# EAGLE board NHK2016mother (EAGLE 6.2)
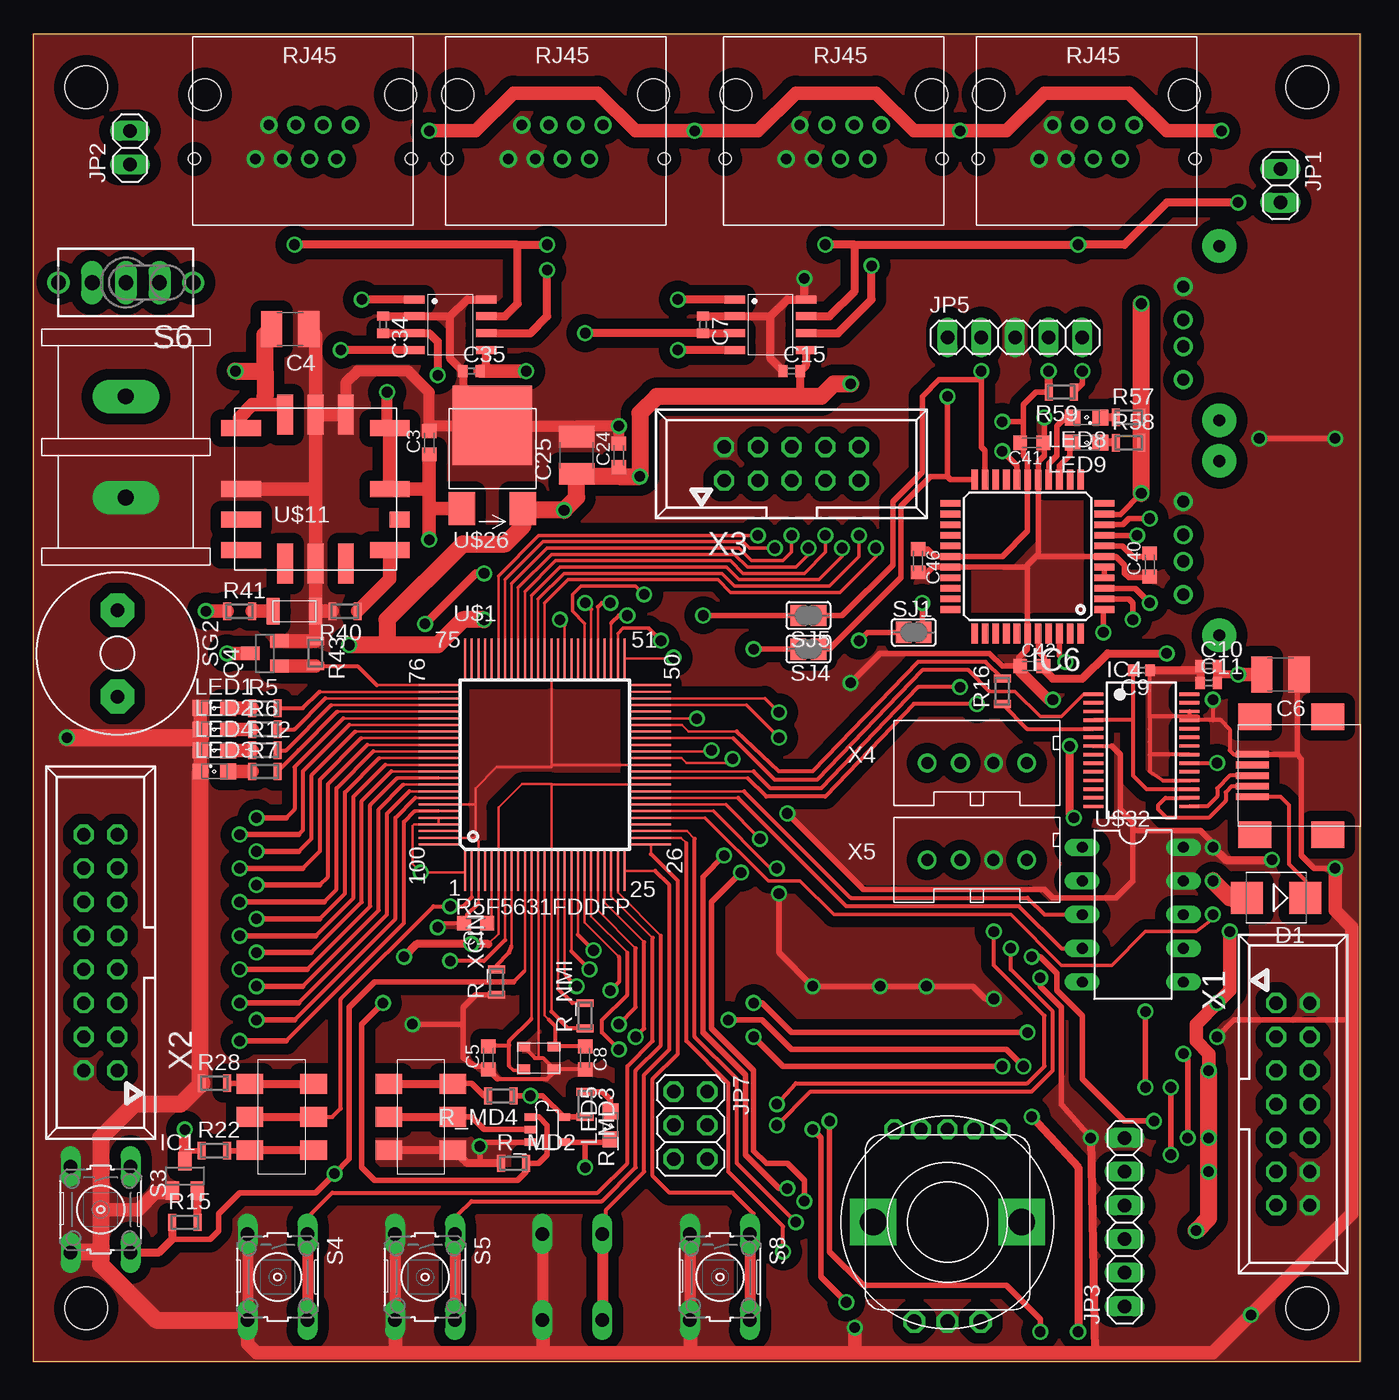
[diagram p2: board, top side]
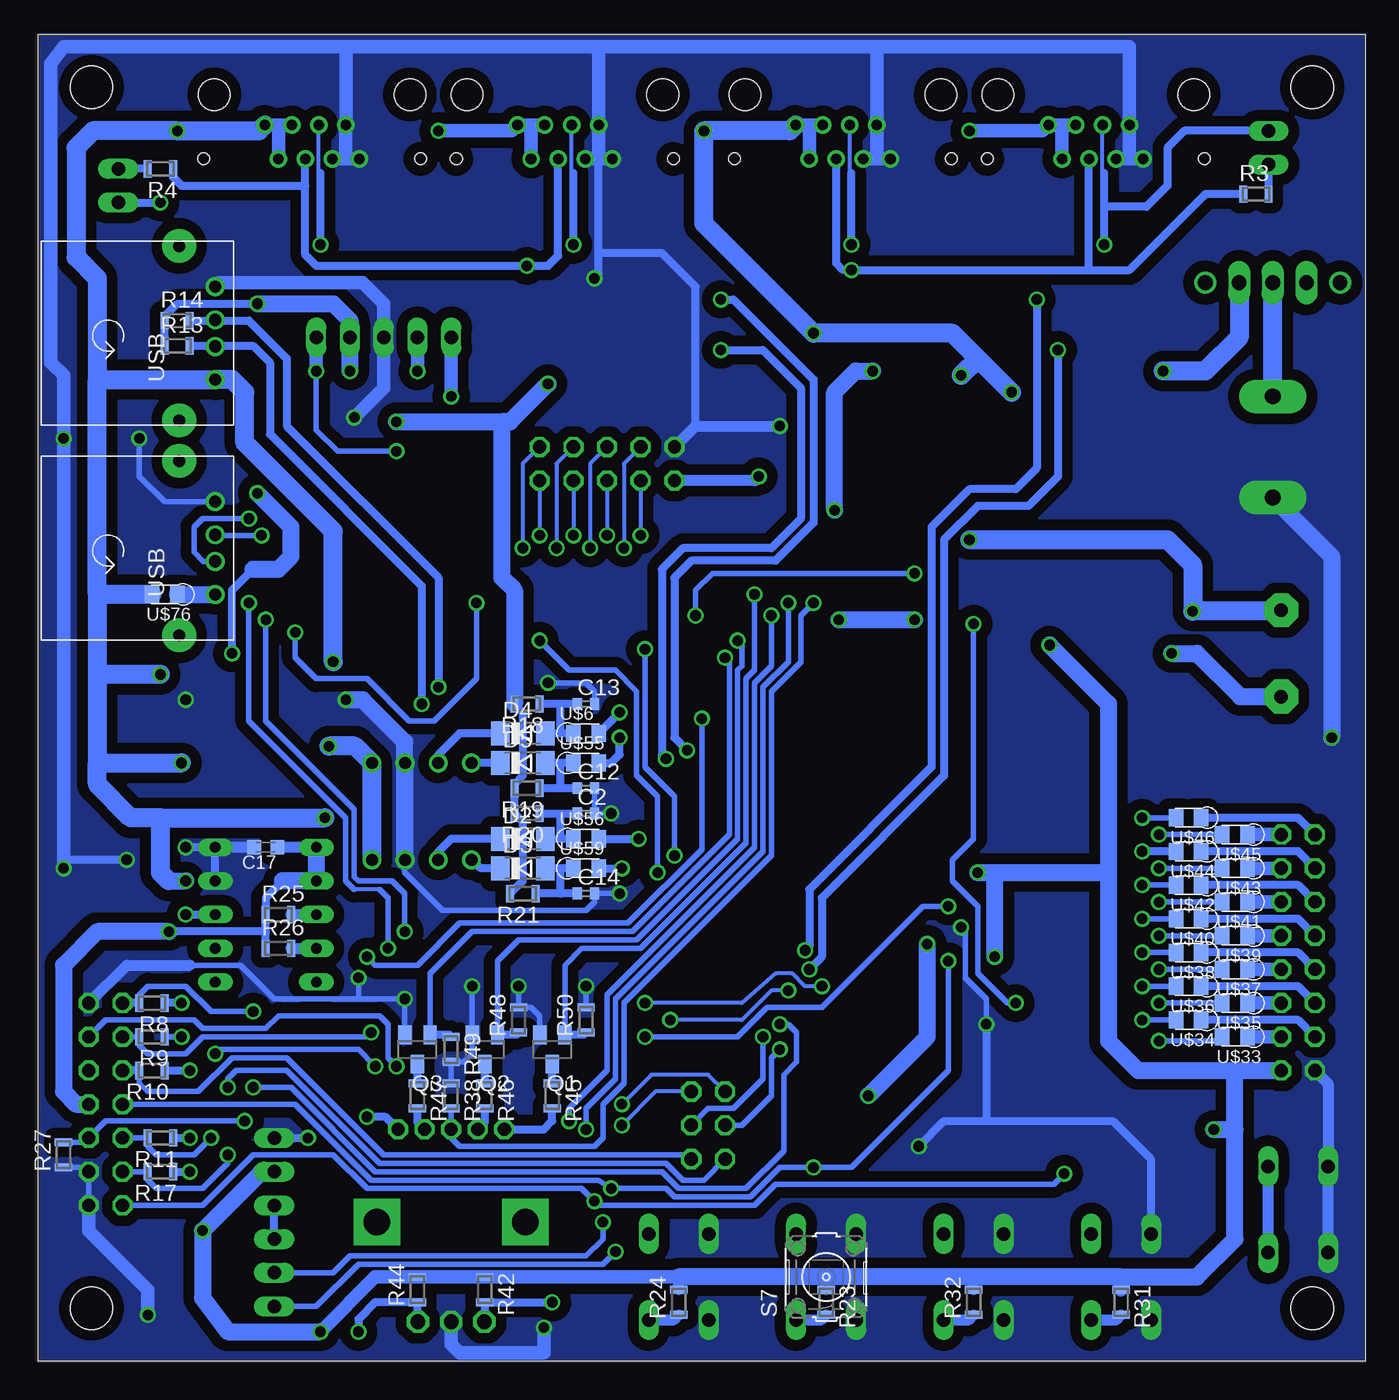
[diagram p3: board, bottom side, seen from below]

Size 100 x 100 mm. Coordinates in mm from the lower left corner, seen from the top.
Outline: 0,0 100,0 100,100 0,100 0,0
Copper layers (1*16): Top 0.035mm / dielectric 1.5mm / Bottom 0.035mm
Design rules "default": minimum track width 0.1mm, minimum drill 24mil, track to track 8mil, track to pad 8mil, pad to pad 8mil, via to via 8mil, smd to smd 8mil, copper to edge 0mil, drill to drill 8mil, minimum pad ring 10mil, minimum via ring 8mil, stop-mask expansion 4mil, vias tented up to drill 0mil, thermal gap 10mil
Holes 3.2 mm at 4,96 4,4 96,4 96,96

## Footprints (pad centres in the part's own frame; a part is rotated, then mirrored left to right if it is on the bottom)
C0603K = smd 1.05 x 1.08: 1 -0.875,0; 2 0.875,0
C0402 = smd 0.7 x 0.9: 1 -0.65,0; 2 0.65,0
C3225 = smd 1.6 x 2.7: 1 -1.4,0; 2 1.4,0
SMB = smd 2.4 x 2.4: A 2.2,0; C -2.2,0
SOD80C = smd 1.4 x 1.8: A 1.7,0; C -1.7,0
SOT23B-3 = smd 1 x 1.4: 1 -0.95,-1.1; 2 0.95,-1.1; 3 0,1.1
SSOP28 = smd 0.25 x 1.5: 1 -4.225,-3.625; 2 -3.575,-3.625; 3 -2.925,-3.625; 4 -2.275,-3.625; 5 -1.625,-3.625; 6 -0.975,-3.625; 7 -0.325,-3.625; 8 0.325,-3.625; 9 0.975,-3.625; 10 1.625,-3.625; 11 2.275,-3.625; 12 2.925,-3.625; 13 3.575,-3.625; 14 4.225,-3.625; 15 4.225,3.625; 16 3.575,3.625; 17 2.925,3.625; 18 2.275,3.625; 19 1.625,3.625; 20 0.975,3.625; 21 0.325,3.625; 22 -0.325,3.625; 23 -0.975,3.625; 24 -1.625,3.625; 25 -2.275,3.625; 26 -2.925,3.625; 27 -3.575,3.625; 28 -4.225,3.625
TQFP44 = smd 1.5 x 0.5: 1 -5.8,4; 2 -5.8,3.2; 3 -5.8,2.4; 4 -5.8,1.6; 5 -5.8,0.8; 6 -5.8,0; 7 -5.8,-0.8; 8 -5.8,-1.6; 9 -5.8,-2.4; 10 -5.8,-3.2; 11 -5.8,-4; 23 5.8,-4; 24 5.8,-3.2; 25 5.8,-2.4; 26 5.8,-1.6; 27 5.8,-0.8; 28 5.8,0; 29 5.8,0.8; 30 5.8,1.6; 31 5.8,2.4; 32 5.8,3.2; 33 5.8,4 | smd 0.5 x 1.5: 12 -4,-5.8; 13 -3.2,-5.8; 14 -2.4,-5.8; 15 -1.6,-5.8; 16 -0.8,-5.8; 17 0,-5.8; 18 0.8,-5.8; 19 1.6,-5.8; 20 2.4,-5.8; 21 3.2,-5.8; 22 4,-5.8; 34 4,5.8; 35 3.2,5.8; 36 2.4,5.8; 37 1.6,5.8; 38 0.8,5.8; 39 0,5.8; 40 -0.8,5.8; 41 -1.6,5.8; 42 -2.4,5.8; 43 -3.2,5.8; 44 -4,5.8
1X02 = drill 1.016 long: 1 -1.27,0; 2 1.27,0
1X06 = drill 1.016 long: 1 -6.35,0; 2 -3.81,0; 3 -1.27,0; 4 1.27,0; 5 3.81,0; 6 6.35,0
1X05 = drill 1.016 long: 1 -5.08,0; 2 -2.54,0; 3 0,0; 4 2.54,0; 5 5.08,0
2X03 = drill 1.016 octagon: 1 -2.54,-1.27; 2 -2.54,1.27; 3 0,-1.27; 4 0,1.27; 5 2.54,-1.27; 6 2.54,1.27
SML0805 = smd 1.2 x 1.2: A 1.05,0; C -1.05,0
SOT23 = smd 1 x 1.4: 1 -0.95,-1.1; 2 0.95,-1.1; 3 0,1.1
MINI_MELF-0102W = smd 0.6 x 1.3: 1 -0.95,0; 2 0.95,0
B3F-10XX = drill 1.016 long: 1 -3.251,2.261; 2 3.251,2.261; 3 -3.251,-2.261; 4 3.251,-2.261
TL3XYO = drill 1.1 pad 1.422 long: 1 -2.54,0; 2 0,0; 3 2.54,0 | drill 1.1 pad 1.676: M1 -5.08,0; M2 5.08,0
AL60P = drill 1.016 pad 2.54 octagon: 1 -3.251,0; 2 3.251,0
SJ = smd 1.168 x 1.6: 1 -0.762,0; 2 0.762,0
LQFP100 = smd 0.15 x 3: 1 -6.5,-7.5; 2 -6,-7.5; 3 -5.5,-7.5; 4 -5,-7.5; 5 -4.5,-7.5; 6 -4,-7.5; 7 -3.5,-7.5; 8 -3,-7.5; 9 -2.5,-7.5; 10 -2,-7.5; 11 -1.5,-7.5; 12 -1,-7.5; 13 -0.5,-7.5; 14 0,-7.5; 15 0.5,-7.5; 16 1,-7.5; 17 1.5,-7.5; 18 2,-7.5; 19 2.5,-7.5; 20 3,-7.5; 21 3.5,-7.5; 22 4,-7.5; 23 4.5,-7.5; 24 5,-7.5; 25 5.5,-7.5; 51 5.5,8.5; 52 5,8.5; 53 4.5,8.5; 54 4,8.5; 55 3.5,8.5; 56 3,8.5; 57 2.5,8.5; 58 2,8.5; 59 1.5,8.5; 60 1,8.5; 61 0.5,8.5; 62 0,8.5; 63 -0.5,8.5; 64 -1,8.5; 65 -1.5,8.5; 66 -2,8.5; 67 -2.5,8.5; 68 -3,8.5; 69 -3.5,8.5; 70 -4,8.5; 71 -4.5,8.5; 72 -5,8.5; 73 -5.5,8.5; 74 -6,8.5; 75 -6.5,8.5 | smd 3 x 0.15: 26 7.5,-5.5; 27 7.5,-5; 28 7.5,-4.5; 29 7.5,-4; 30 7.5,-3.5; 31 7.5,-3; 32 7.5,-2.5; 33 7.5,-2; 34 7.5,-1.5; 35 7.5,-1; 36 7.5,-0.5; 37 7.5,0; 38 7.5,0.5; 39 7.5,1; 40 7.5,1.5; 41 7.5,2; 42 7.5,2.5; 43 7.5,3; 44 7.5,3.5; 45 7.5,4; 46 7.5,4.5; 47 7.5,5; 48 7.5,5.5; 49 7.5,6; 50 7.5,6.5; 76 -8.5,6.5; 77 -8.5,6; 78 -8.5,5.5; 79 -8.5,5; 80 -8.5,4.5; 81 -8.5,4; 82 -8.5,3.5; 83 -8.5,3; 84 -8.5,2.5; 85 -8.5,2; 86 -8.5,1.5; 87 -8.5,1; 88 -8.5,0.5; 89 -8.5,0; 90 -8.5,-0.5; 91 -8.5,-1; 92 -8.5,-1.5; 93 -8.5,-2; 94 -8.5,-2.5; 95 -8.5,-3; 96 -8.5,-3.5; 97 -8.5,-4; 98 -8.5,-4.5; 99 -8.5,-5; 100 -8.5,-5.5
MUSB-5BF02AS-N = smd 0.5 x 2.5: 1 1.6,1.05; 2 0.8,1.05; 3 0,1.05; 4 -0.8,1.05; 5 -1.6,1.05 | smd 2 x 2.5: P$6 4.45,1.25; P$7 -4.45,1.25; P$8 4.45,6.75; P$9 -4.45,6.75
MCP2562 = smd 1.55 x 0.6: 1 -2.7,2.54; 2 -2.7,1.27; 3 -2.7,0; 4 -2.7,-1.27; 5 2.7,-1.27; 6 2.7,0; 7 2.7,1.27; 8 2.7,2.54
RJ45 = drill 0.8: P$1 -3.57,-0.44; P$2 -2.55,2.1; P$3 -1.53,-0.44; P$4 -0.51,2.1; P$5 0.51,-0.44; P$6 1.53,2.1; P$7 2.55,-0.44; P$8 3.57,2.1 | hole 2.4: -7.375,-2.74; 7.375,-2.74 | hole 0.9: -8.175,2.1; 8.175,2.1
2012 = smd 1.1 x 1.3: 1 -0.95,0; 2 0.95,0
SSSS2 = smd 1.5 x 2: 1 -2.5,2.4; 2 0,2.4; 3 2.5,2.4; 4 -2.5,-2.4; 5 0,-2.4; 6 2.5,-2.4
ＦＲ１１０５Ｗ－ＴＲ = smd 1 x 2: A -1.6,0; K 1.6,0
TERMINAL = drill 1.2 pad 2.54 long: P$1 -3.81,0; P$2 3.81,0
OKL_T6_W12 = smd 1.2 x 3: GND@0 0,-5.6; GND@1 2.29,5.6; GND@2 0,5.6; NC@1 -2.29,-5.6; NC@2 2.29,-5.6; VIN@0 -2.29,5.6 | smd 3 x 1.2: NC@0 -5.6,-4.58; ON/OFF -5.6,0; PGOOD -5.6,-2.29; SENSE 5.6,0; TRIM 5.6,-4.58; VIN@1 -5.6,4.58; VOUT 5.6,4.58 | smd 1.5 x 1.2: NC@3 6.35,-2.29
TO-252-3-L1 = smd 2 x 2.5: 1 -2.3,-4; 3 2.3,-4 | smd 6 x 6: 2 0,2.25
USB_A = drill 0.92: 1 3.5,0; 2 1,0; 3 -1,0; 4 -3.5,0 | drill 0.9 pad 2.54: PAD@1 6.57,-2.71; PAD@2 -6.57,-2.71
MPU9150 = drill 0.813 long: 1 -5.08,-3.81; 2 -2.54,-3.81; 3 0,-3.81; 4 2.54,-3.81; 5 5.08,-3.81; 6 5.08,3.81; 7 2.54,3.81; 8 0,3.81; 9 -2.54,3.81; 10 -5.08,3.81
EC12PLRGBSDVBF = drill 1 pad 1.422 octagon: 1 -4,7; 2 -2,7; 3 0,7; 4 2,7; 5 4,7 | drill 1.1 pad 1.676 octagon: 6 2.5,-7.5; 7 0,-7.5; 8 -2.5,-7.5 | drill 2 pad 3.5 square: P$9 -5.6,0; P$10 5.6,0
FA238V = smd 0.95 x 0.75: 1 -1.15,-0.85; 2 1.15,-0.85; 3 1.15,0.85; 4 -1.15,0.85
SOT23-5 = smd 0.57 x 0.95: 1 -0.95,-1.25; 2 0,-1.25; 3 0.95,-1.25; 4 0.95,1.25; 5 -0.95,1.25
057-014-1 = drill 1 octagon: 1 -7.62,-1.27; 2 -7.62,1.27; 3 -5.08,-1.27; 4 -5.08,1.27; 5 -2.54,-1.27; 6 -2.54,1.27; 7 0,-1.27; 8 0,1.27; 9 2.54,-1.27; 10 2.54,1.27; 11 5.08,-1.27; 12 5.08,1.27; 13 7.62,-1.27; 14 7.62,1.27
057-016-1 = drill 1 octagon: 1 -8.89,-1.27; 2 -8.89,1.27; 3 -6.35,-1.27; 4 -6.35,1.27; 5 -3.81,-1.27; 6 -3.81,1.27; 7 -1.27,-1.27; 8 -1.27,1.27; 9 1.27,-1.27; 10 1.27,1.27; 11 3.81,-1.27; 12 3.81,1.27; 13 6.35,-1.27; 14 6.35,1.27; 15 8.89,-1.27; 16 8.89,1.27
057-010-1 = drill 1 octagon: 1 -5.08,-1.27; 2 -5.08,1.27; 3 -2.54,-1.27; 4 -2.54,1.27; 5 0,-1.27; 6 0,1.27; 7 2.54,-1.27; 8 2.54,1.27; 9 5.08,-1.27; 10 5.08,1.27
XA-4P = drill 0.9: 1 -3.75,0; 2 -1.25,0; 3 1.25,0; 4 3.75,0

## Placement (x,y rotation side)
C1  0.1uF  [C0603K]  33.34,33.02 180 top
C2  0.01u  [C0402]  58.74,41.27 0 bottom
C3  0.1uF  [C0603K]  29.84,69.22 90 top
C4  47u  [C3225]  19.37,77.79 180 top
C5  22p  [C0603K]  34.29,22.86 90 top
C6  47u  [C3225]  93.98,51.75 180 top
C7  0.1u  [C0402]  50.48,78.11 270 top
C8  22p  [C0603K]  41.59,22.86 270 top
C9  0.1u  [C0402]  83.5,52.07 180 top
C10  0.1u  [C0402]  88.58,52.39 0 top
C11  0.1u  [C0402]  88.58,51.12 0 top
C12  0.01u  [C0402]  58.74,43.18 0 bottom
C13  0.01u  [C0402]  58.74,49.53 0 bottom
C14  0.01u  [C0402]  58.74,35.24 0 bottom
C15  0.1u  [C0402]  57.15,74.61 0 top
C17  0.1uF  [C0603K]  82.87,38.73 180 bottom
C24  0.1uF  [C0603K]  44.13,68.26 90 top
C25  47u  [C3225]  40.96,68.26 90 top
C34  0.1u  [C0402]  26.35,78.11 270 top
C35  0.1u  [C0402]  33.02,74.61 0 top
C40  10u  [C0603K]  84.14,60.01 90 top
C41  0.1u  [C0603K]  75.25,69.22 180 top
C42  0.1u  [C0603K]  75.25,52.39 0 top
C46  0.1u  [C0603K]  66.67,60.33 270 top
D1  ES2D  [SMB]  93.66,34.92 180 top
D2  PMLL4150  [SOD80C]  63.5,39.37 0 bottom
D3  PMLL4150  [SOD80C]  63.5,37.15 0 bottom
D4  PMLL4150  [SOD80C]  63.5,47.31 0 bottom
D5  PMLL4150  [SOD80C]  63.5,45.09 0 bottom
IC1  [SOT23B-3]  11.43,13.97 0 top
IC4  FT232RL  [SSOP28]  83.5,46.04 270 top
IC6  PIC24FJ64GA004  [TQFP44]  74.93,60.64 180 top
JP1  [1X02]  93.98,88.58 270 top
JP2  [1X02]  7.3,91.44 90 top
JP3  [1X06]  82.23,10.48 90 top
JP5  [1X05]  73.98,77.15 0 top
JP7  [2X03]  49.53,17.78 270 top
LED1  [SML0805]  13.65,49.21 0 top
LED2  [SML0805]  13.65,47.62 0 top
LED3  [SML0805]  13.65,44.45 0 top
LED4  [SML0805]  13.65,46.04 0 top
LED5  [SML0805]  43.5,17.78 90 top
LED8  [SML0805]  79.38,71.12 180 top
LED9  [SML0805]  79.38,69.22 180 top
Q1  [SOT23]  61.28,23.5 180 bottom
Q2  [SOT23]  66.36,23.5 180 bottom
Q3  [SOT23]  71.44,23.5 180 bottom
Q4  [SOT23]  17.46,53.34 90 top
R3  120  [MINI_MELF-0102W]  8.26,87.95 0 bottom
R4  120  [MINI_MELF-0102W]  90.81,89.85 180 bottom
R5  [MINI_MELF-0102W]  17.46,49.21 0 top
R6  [MINI_MELF-0102W]  17.46,47.62 0 top
R7  [MINI_MELF-0102W]  17.46,44.45 0 top
R8  10k  [MINI_MELF-0102W]  91.44,26.99 180 bottom
R9  10k  [MINI_MELF-0102W]  91.44,24.45 180 bottom
R10  10k  [MINI_MELF-0102W]  91.44,21.91 180 bottom
R11  10k  [MINI_MELF-0102W]  90.81,16.83 180 bottom
R12  [MINI_MELF-0102W]  17.46,46.04 0 top
R13  22  [MINI_MELF-0102W]  89.53,76.52 0 bottom
R14  22  [MINI_MELF-0102W]  89.53,78.42 0 bottom
R15  [MINI_MELF-0102W]  11.43,10.48 0 top
R16  0  [MINI_MELF-0102W]  73.03,50.48 90 top
R17  10k  [MINI_MELF-0102W]  90.81,14.29 180 bottom
R18  200  [MINI_MELF-0102W]  63.18,49.53 180 bottom
R19  200  [MINI_MELF-0102W]  63.18,43.18 180 bottom
R20  200  [MINI_MELF-0102W]  63.18,41.27 180 bottom
R21  200  [MINI_MELF-0102W]  63.5,35.24 180 bottom
R22  10k  [MINI_MELF-0102W]  13.65,15.88 0 top
R23  [MINI_MELF-0102W]  40.64,4.45 270 bottom
R24  [MINI_MELF-0102W]  51.75,4.45 90 bottom
R25  1k  [MINI_MELF-0102W]  81.92,33.66 0 bottom
R26  1k  [MINI_MELF-0102W]  81.92,31.11 0 bottom
R27  10k  [MINI_MELF-0102W]  98.11,15.56 90 bottom
R28  0  [MINI_MELF-0102W]  13.65,20.95 0 top
R31  [MINI_MELF-0102W]  18.41,4.45 270 bottom
R32  [MINI_MELF-0102W]  29.53,4.45 90 bottom
R38  [MINI_MELF-0102W]  68.9,20 270 bottom
R40  1.33k  [MINI_MELF-0102W]  23.5,56.52 180 top
R41  120  [MINI_MELF-0102W]  15.56,56.52 0 top
R42  [MINI_MELF-0102W]  66.36,5.4 270 bottom
R43  10k  [MINI_MELF-0102W]  21.27,53.34 270 top
R44  [MINI_MELF-0102W]  71.44,5.4 90 bottom
R45  [MINI_MELF-0102W]  61.28,20 270 bottom
R46  [MINI_MELF-0102W]  66.36,20 270 bottom
R47  [MINI_MELF-0102W]  71.44,20 270 bottom
R48  10k  [MINI_MELF-0102W]  63.82,25.72 90 bottom
R49  10k  [MINI_MELF-0102W]  68.9,23.5 270 bottom
R50  10k  [MINI_MELF-0102W]  58.74,25.72 90 bottom
R57  1k  [MINI_MELF-0102W]  82.55,71.12 0 top
R58  1k  [MINI_MELF-0102W]  82.55,69.22 0 top
R59  10k  [MINI_MELF-0102W]  77.47,73.03 180 top
R_MD2  [MINI_MELF-0102W]  36.2,14.92 0 top
R_MD3  [MINI_MELF-0102W]  41.59,19.37 270 top
R_MD4  [MINI_MELF-0102W]  35.24,20 180 top
R_NMI  [MINI_MELF-0102W]  41.59,26.04 90 top
R_XCIN  [MINI_MELF-0102W]  34.92,28.57 90 top
S3  [B3F-10XX]  5.08,11.43 270 top
S4  [B3F-10XX]  18.41,6.35 270 top
S5  [B3F-10XX]  29.53,6.35 270 top
S6  TL32YO  [TL3XYO]  6.99,81.28 180 top
S7  [B3F-10XX]  40.64,6.35 90 bottom
S8  [B3F-10XX]  51.75,6.35 270 top
SG2  AL60P  [AL60P]  6.35,53.34 270 top
SJ1  [SJ]  66.36,54.93 0 top
SJ4  [SJ]  58.42,53.66 180 top
SJ5  [SJ]  58.42,56.2 180 top
U$1  R5F5631FDDFP  [LQFP100]  39.05,44.45 0 top
U$2  MUSB-5BF02AS-N  [MUSB-5BF02AS-N]  90.81,44.13 270 top
U$3  MCP2562  [MCP2562]  55.56,77.47 0 top
U$4  RJ45  [RJ45]  79.38,92.71 180 top
U$5  RJ45  [RJ45]  60.33,92.71 180 top
U$6  FB1.25MM  [2012]  58.74,47.31 0 bottom
U$7  SSSS2  [SSSS2]  18.73,18.41 270 top
U$8  ＦＲ１１０５Ｗ－ＴＲ  [ＦＲ１１０５Ｗ－ＴＲ]  19.68,56.52 0 top
U$9  RJ45  [RJ45]  39.37,92.71 180 top
U$10  TERMINAL  [TERMINAL]  6.99,68.9 270 top
U$11  OKL_T6_W12  [OKL_T6_W12]  21.27,65.72 0 top
U$17  MCP2562  [MCP2562]  31.43,77.47 0 top
U$26  NJM2845DL1  [TO-252-3-L1]  34.61,68.26 0 top
U$27  RJ45  [RJ45]  20.32,92.71 180 top
U$29  USB_A  [USB_A]  86.68,77.47 270 bottom
U$32  MPU9150  [MPU9150]  82.87,33.66 270 top
U$33  FB1.25MM  [2012]  9.84,24.45 180 bottom
U$34  FB1.25MM  [2012]  13.34,25.72 180 bottom
U$35  FB1.25MM  [2012]  9.84,26.99 180 bottom
U$36  FB1.25MM  [2012]  13.34,28.26 180 bottom
U$37  FB1.25MM  [2012]  9.84,29.53 180 bottom
U$38  FB1.25MM  [2012]  13.34,30.8 180 bottom
U$39  FB1.25MM  [2012]  9.84,32.07 180 bottom
U$40  FB1.25MM  [2012]  13.34,33.34 180 bottom
U$41  FB1.25MM  [2012]  9.84,34.61 180 bottom
U$42  FB1.25MM  [2012]  13.34,35.88 180 bottom
U$43  FB1.25MM  [2012]  9.84,37.15 180 bottom
U$44  FB1.25MM  [2012]  13.34,38.42 180 bottom
U$45  FB1.25MM  [2012]  9.84,39.69 180 bottom
U$46  FB1.25MM  [2012]  13.34,40.96 180 bottom
U$55  FB1.25MM  [2012]  58.74,45.09 0 bottom
U$56  FB1.25MM  [2012]  58.74,39.37 0 bottom
U$58  EC12PLRGBSDVBF  [EC12PLRGBSDVBF]  68.9,10.48 0 top
U$59  FB1.25MM  [2012]  58.74,37.15 0 bottom
U$61  FA238V  [FA238V]  38.1,22.86 180 top
U$68  3STATE  [SOT23-5]  38.73,17.46 270 top
U$75  USB_A  [USB_A]  86.68,61.28 270 bottom
U$76  FB1.25MM  [2012]  90.49,57.78 180 bottom
U$82  SSSS2  [SSSS2]  29.21,18.41 90 top
X1  057-014-1  [057-014-1]  94.93,19.37 270 top
X2  057-016-1  [057-016-1]  5.08,30.8 90 top
X3  057-010-1  [057-010-1]  57.15,67.63 0 top
X4  XA-4PNORMAL  [XA-4P]  71.12,45.09 180 top
X5  XA-4PNORMAL  [XA-4P]  71.12,37.78 180 top

## Tracks (layer width: path | path; a pad name or v marks a point on that pad's centre or on a via)
+3V3  (via drill 0.8)
  Top 0.2: 39.05,26.35 U$1.14 39.05,43.5 | U$1.96 U$1.97 28.7,40.45 28.57,40.32 28.57,37.47 v29.21,36.83 32.43,36.83 U$1.1 | 34.29,31.43 35.05,32.2 U$1.6 35.05,41.72 36.83,43.5 39.05,43.5 | 40.05,55.52 U$1.60 | 39.05,43.5 39.1,43.45 U$1.35
  Top 0.254: R_NMI.1 41.27,25.08
  Top 0.305: R_NMI.1 40.32,25.08 39.05,26.35 | 40.05,55.52 v39.69,55.88
  Top 0.406: R_MD3.2 arc-90 R_MD3.2 U$68.5 38.4,20 v37.47,20 R_MD4.1 | 74.61,70.8 74.61,69.45 C41.2 74.61,68.97 74.61,68.26 74.93,67.94 IC6.17 74.93,62.55 73.03,60.64 IC6.28 67.94,60.64 67.39,61.2 C46.1 | 74.61,70.8 74.61,72.07 75.56,73.03 R59.2 76.52,73.34 | R58.2 v83.5,65.4 v83.5,65.41 81.92,63.82 80.75,63.82 IC6.10 | IC6.40 75.73,53.49 76.2,53.02 76.2,52.47 C42.2 76.12,52.15 | R22.1 11.43,15.88 | v73.03,70.8 74.61,70.8
  Top 0.61: C35.2 34.13,75.08 U$17.5 | 76.52,73.34 v76.52,74.61 | R58.2 R57.2 | 34.29,31.43 v33.02,31.43 28.89,31.43 v27.94,30.48 | v75.25,18.41 78.74,14.61 v78.74,2.22 | 76.12,52.15 76.83,51.44 79.06,51.44 80.96,53.34 v85.41,53.34 | 57.78,72.71 57.78,74.6 C15.2 58.26,75.08 U$3.5
  Top 0.813: IC1.3 11.43,15.88 v11.43,17.46 | U$26.3 37.03,64.14 | 41.27,66.67 41.15,66.55 C25.1 | C24.1 44.13,66.67
  Top 1.016: U$26.3 36.83,64.19 | v37.15,74.61 C35.2 | v88.58,21.91 88.58,23.18 87.63,24.13 87.63,25.4 v89.22,26.99 90.17,27.94 v90.17,32.38
  Top 1.27: C25.1 40.96,65.09 v40.01,64.14 36.91,64.14 U$26.3 36.91,62.94 35.56,61.59 32.38,61.59 26.67,55.88 26.67,53.98 | 41.27,66.67 44.13,66.67 v45.72,66.67 45.72,71.44 46.99,72.71 57.78,72.71 59.37,72.71 60.33,73.66 v61.59,73.66 | 36.83,64.19 36.83,63.82 | 26.67,53.98 v23.81,53.98 | v33.97,55.88 32.38,55.88 30.48,53.98 26.67,53.98 | v87.63,9.84 88.58,10.79 v88.58,14.29 v88.58,16.83 v88.58,21.91 | v83.5,65.41 v83.5,79.69
  Bottom 0.406: R13.1 90.49,78.74
  Bottom 0.61: R13.1 R14.1 | 81.6,36.2 82.86,34.93 R25.1 R26.1 82.87,32.38 v90.17,32.38 | R18.2 63.5,48.9 63.5,44.13 64.13,43.5 R19.2 R20.2 63.5,40.64 63.5,36.19 R21.2 | U$58.5 73.83,18.41 v75.25,18.41 | v89.22,26.99 R8.1 | R10.1 v88.58,21.91 | R11.1 v88.58,16.83 | R17.1 v88.58,14.29 | 90.49,78.74 89.53,79.69 v83.5,79.69 | v85.41,53.34 85.41,58.1 83.82,59.69
  Bottom 0.813: R32.2 29.53,6.35 | R23.1 40.64,6.35 | R24.2 51.75,6.35 | 9.84,21.91 X2.1 | v45.72,66.67 46.04,66.36 X3.1 | U$32.1 C17.1
  Bottom 1.016: R31.1 18.41,6.35 | 76.52,76.52 JP5.4 | v78.74,2.22 74.61,6.35 R44.2 R42.1 65.41,6.35 51.75,6.35
  Bottom 1.27: 51.75,6.35 40.64,6.35 29.53,6.35 18.41,6.35 12.7,6.35 9.84,9.21 9.84,17.46 | 9.84,17.46 9.84,21.91 | v11.43,17.46 9.84,17.46 | v76.52,74.61 76.52,76.52 76.52,78.42 77.79,79.69 v83.5,79.69 | U$32.1 U$32.2 81.6,36.2 | v40.01,64.14 40.01,73.03 38.42,74.61 v37.15,74.61 | v23.81,53.98 19.37,49.53 19.37,36.83 | 19.37,36.83 19.37,24.13 17.14,21.91 X2.1 | v29.21,36.83 27.94,36.83 | 27.94,36.83 19.37,36.83 | v27.94,30.48 27.94,36.83 | v39.69,55.88 v33.97,55.88 | v37.47,20 33.02,24.45 v33.02,31.43 | JP3.5 83.19,14.29 v87.63,9.84 87.63,4.76 85.72,2.22 v78.74,2.22 | v90.17,32.38 95.57,32.38 98.11,29.84 98.11,20.32 97.16,19.37 X1.8 | v61.59,73.66 64.45,70.8 65.09,70.8 | v73.03,70.8 65.09,70.8 | 65.09,70.8 65.09,59.05 64.13,58.1 R18.2 | 83.82,59.69 81.92,59.69 80.96,60.64 80.96,62.87 v83.5,65.41
AN000  (via drill 0.8)
  Top 0.254: 28.75,41.45 U$1.95
  Top 0.305: 19.05,24.13 27.94,33.02 27.94,40.64 28.75,41.45
  Top 0.406: v15.56,24.13 19.05,24.13
  Bottom 0.406: U$33.2 11.11,24.13 v15.56,24.13
AN001  (via drill 0.8)
  Top 0.2: 28.8,42.45 U$1.93
  Top 0.305: 19.68,25.72 27.3,33.34 27.3,40.96 28.8,42.45
  Top 0.406: v16.83,25.72 17.14,25.72 19.68,25.72
  Bottom 0.406: U$34.2 v16.83,25.72
AN002  (via drill 0.8)
  Top 0.2: 28.34,42.95 U$1.92
  Top 0.305: 20,26.99 26.67,33.66 26.67,41.27 28.34,42.95
  Top 0.406: v15.56,26.99 20,26.99
  Bottom 0.406: U$35.2 v15.56,26.99
AN003  (via drill 0.8)
  Top 0.2: 27.89,43.45 U$1.91
  Top 0.305: 20.32,28.26 26.04,33.97 26.04,41.59 27.89,43.45
  Top 0.406: v16.83,28.26 20.32,28.26
  Bottom 0.406: U$36.2 v16.83,28.26
AN004  (via drill 0.8)
  Top 0.254: 27.44,43.95 U$1.90
  Top 0.305: 20.64,29.53 25.4,34.29 25.4,41.91 27.44,43.95
  Top 0.406: v15.56,29.53 20.64,29.53
  Bottom 0.406: U$37.2 v15.56,29.53
AN005  (via drill 0.8)
  Top 0.2: 26.99,44.45 U$1.89
  Top 0.305: 20.95,30.8 24.77,34.61 24.77,42.23 26.99,44.45
  Top 0.406: v16.83,30.8 20.95,30.8
  Bottom 0.406: U$38.2 v16.83,30.8
AN006  (via drill 0.8)
  Top 0.2: 26.54,44.95 U$1.88
  Top 0.305: 21.27,32.07 24.13,34.92 24.13,42.55 26.54,44.95
  Top 0.406: v15.56,32.07 21.27,32.07
  Bottom 0.406: U$39.2 v15.56,32.07
AN007  (via drill 0.8)
  Top 0.2: 26.08,45.45 U$1.87
  Top 0.305: 21.59,33.34 23.5,35.24 23.5,42.86 26.08,45.45
  Top 0.406: v16.83,33.34 21.59,33.34
  Bottom 0.406: U$40.2 v16.83,33.34
AN008  (via drill 0.8)
  Top 0.2: 25.63,45.95 U$1.86
  Top 0.305: 21.91,34.61 22.86,35.56 22.86,43.18 25.63,45.95
  Top 0.406: v15.56,34.61 21.91,34.61
  Bottom 0.406: U$41.2 v15.56,34.61
AN009  (via drill 0.8)
  Top 0.2: 25.18,46.45 U$1.85
  Top 0.305: 21.59,35.88 22.23,36.51 22.23,43.5 25.18,46.45
  Top 0.406: v16.83,35.88 21.59,35.88
  Bottom 0.406: U$42.2 v16.83,35.88
AN010  (via drill 0.8)
  Top 0.2: 24.73,46.95 U$1.84
  Top 0.305: 24.73,46.95 21.59,43.81 21.59,38.42 20.32,37.15
  Top 0.406: v15.56,37.15 17.14,37.15 20.32,37.15
  Bottom 0.406: U$43.2 v15.56,37.15
AN011  (via drill 0.8)
  Top 0.2: 24.27,47.45 U$1.83
  Top 0.305: 24.27,47.45 20.95,44.13 20.95,39.37 20,38.42
  Top 0.406: 20,38.42 v16.83,38.42
  Bottom 0.61: U$44.2 v16.83,38.42
AN012  (via drill 0.8)
  Top 0.2: 23.82,47.95 U$1.82
  Top 0.305: 23.82,47.95 20.32,44.45 20.32,40.01 20,39.69
  Top 0.406: 20,39.69 v15.56,39.69
  Bottom 0.406: U$45.2 v15.56,39.69
AN013  (via drill 0.8)
  Top 0.2: 23.37,48.45 U$1.81
  Top 0.305: 23.37,48.45 19.68,44.77 19.68,41.59 19.05,40.96
  Top 0.406: 19.05,40.96 v16.83,40.96
  Bottom 0.406: U$46.2 v16.83,40.96
CRX0  (via drill 0.8)
  Top 0.2: 40.55,30.89 U$1.17
  Top 0.305: v41.91,29.53 40.55,30.89
  Top 0.61: U$17.4 v23.18,76.2
  Bottom 0.61: v23.18,76.2 23.18,66.67 25.4,64.45 29.21,64.45 31.75,61.91 31.75,44.13 40.96,34.92 40.96,30.48 v41.91,29.53
CRX1  (via drill 0.8)
  Top 0.2: v52.7,45.4 52.39,45.09 49.21,45.09 48.85,45.45 U$1.39
  Top 0.61: 53.02,76.2 U$3.4 v48.58,76.2
  Bottom 0.61: v48.58,76.2 45.4,76.2 42.55,73.34 42.55,63.5 44.77,61.28 51.44,61.28 53.02,59.69 53.02,45.72 v52.7,45.4
CTS-RTS0
  Bottom 0.61: JP3.3 JP3.4
CTS/RTS
  Top 0.406: IC6.5 IC6.4
CTX0  (via drill 0.8)
  Top 0.2: 41.05,32.13 U$1.18
  Top 0.305: v42.23,30.96 41.05,32.13
  Top 0.61: U$17.1 v24.77,80.01
  Bottom 0.61: v24.77,80.01 24.77,67.31 26.35,65.72 29.84,65.72 32.7,62.87 32.7,44.77 41.91,35.56 41.91,31.27 v42.23,30.96
CTX1  (via drill 0.8)
  Top 0.2: v51.12,46.04 51.03,45.95 U$1.40
  Top 0.61: U$3.1 v48.58,80.01
  Bottom 0.61: v48.58,80.01 47.62,80.01 41.59,73.98 41.59,63.18 44.45,60.33 50.8,60.33 52.07,59.05 52.07,46.99 v51.12,46.04
E1-RXD1  (via drill 0.8)
  Top 0.406: v85.72,20.64 v85.72,15.56
  Bottom 0.406: X1.11 R17.2 91.75,13.65 91.12,13.02 87.63,13.02 85.72,14.92 v85.72,15.56 | JP7.5 49.85,13.65 51.44,13.65 52.7,14.92 74.3,14.92 81.28,21.91 85.09,21.91 85.72,21.27 v85.72,20.64
E1-TXD1
  Bottom 0.406: JP7.6 51.12,15.56 73.98,15.56 81.28,22.86 85.41,22.86 87.95,20.32 91.76,20.32 92.39,20.95 R10.2
  Bottom 0.61: R10.2 X1.5
EMLE  (via drill 0.8)
  Top 0.2: 33.05,34.96 U$1.2
  Top 0.305: U$7.2 22.54,18.41 23.18,19.05 23.18,27.3 30.16,34.29 v31.43,34.29 32.38,34.29 33.05,34.96
  Top 0.406: v73.03,22.23 56.52,22.23 v54.29,24.45
  Top 0.61: U$7.5 U$7.2
  Bottom 0.406: X1.4 94.93,25.72 88.27,25.72 87.63,25.08 82.87,25.08 81.92,26.04 74.3,26.04 73.66,25.4 73.66,22.86 v73.03,22.23 | v54.29,24.45 47.31,24.45 45.09,26.67 40.96,26.67 33.34,34.29 v31.43,34.29
ENC-A  (via drill 0.8)
  Top 0.2: 42.55,56.84 U$1.55
  Top 0.305: v43.5,57.15 42.86,57.15 42.55,56.84
  Top 0.406: v61.28,4.45 59.37,6.35 59.37,16.83 v58.74,17.46
  Bottom 0.406: R42.2 | v58.74,17.46 58.74,19.05 56.52,21.27 56.52,27.3 45.4,38.42 45.4,50.8 43.5,52.7 v43.5,57.15
  Bottom 0.61: U$58.8 66.36,3.02 R42.2 | R42.2 v61.28,4.45
ENC-B  (via drill 0.8)
  Top 0.2: 43.55,55.62 U$1.53
  Top 0.305: v44.77,56.2 44.13,56.2 43.55,55.62
  Top 0.406: v60.01,18.1 60.01,8.26 62.55,5.71 73.34,5.71 75.88,3.17 v75.88,2.22
  Bottom 0.406: R44.1 | v60.01,18.1 60.01,19.05 57.15,21.91 57.15,27.62 46.04,38.73 46.04,51.12 44.77,52.39 v44.77,56.2
  Bottom 0.61: U$58.6 71.44,3.02 R44.1 | R44.1 74.61,4.45 75.88,3.17 v75.88,2.22
ENC-BLUE  (via drill 0.8)
  Top 0.2: v48.26,53.02 48.19,52.95 U$1.51
  Bottom 0.406: 70.17,24.45 arc90 70.48,24.77 | 70.48,24.77 70.48,29.21 67.31,32.38 55.24,32.38 47.94,39.69 47.94,52.7 v48.26,53.02 | Q3.1 70.48,24.77
  Bottom 0.61: R49.1 69.05,24.59 Q3.1
ENC-GREEN  (via drill 0.8)
  Top 0.2: 44.05,54.85 U$1.52
  Top 0.254: 46.35,55.24 44.45,55.24 44.05,54.85
  Top 0.305: v47.31,54.29 46.35,55.24
  Bottom 0.406: 65.26,24.59 arc-90 65.41,24.45 | 63.97,24.59 65.26,24.59 | 65.26,24.59 arc-90 65.41,24.45 | 65.41,24.45 65.41,30.16 63.82,31.75 54.93,31.75 47.31,39.37 47.31,52.07 46.99,52.39 46.99,53.98 v47.31,54.29
  Bottom 0.61: R48.1 63.97,24.59 Q2.1
ENC-RED  (via drill 0.8)
  Top 0.2: 41.55,55.6 U$1.57
  Top 0.254: v46.04,57.78 45.4,58.42 41.27,58.42 40.64,57.78 40.64,56.52 41.55,55.6
  Bottom 0.406: 60.33,24.45 60.33,29.84 59.05,31.11 54.61,31.11 46.67,39.05 46.67,51.44 46.04,52.07 v46.04,57.78
  Bottom 0.61: R50.1 58.89,24.59 60.18,24.59 | 60.18,24.59 Q1.1 | 60.18,24.59 arc-90 60.33,24.45
ENC-SW  (via drill 0.8)
  Top 0.2: 42.05,56.66 U$1.56
  Top 0.305: v41.59,57.15 42.05,56.66
  Bottom 0.406: v41.59,57.15 42.55,56.2 42.55,52.7 44.77,50.48 44.77,38.1 55.88,26.99 55.88,20.95 57.47,19.37 57.47,16.83 58.1,16.19 68.26,16.19 68.9,16.83 U$58.3 R38.2
EXTAL
  Top 0.2: 38.87,25.74 38.55,26.06 U$1.13
  Top 0.254: U$61.1 39.37,23.83
  Top 0.305: 39.37,23.83 39.37,25.24 38.87,25.74 | C8.1 41.57,23.71 U$61.1
GND  (via drill 0.8)
  Top 0.2: 33.55,34.51 U$1.3 | 39.25,21.79 U$61.4 | 33.34,41.91 33.34,39.37 | 33.34,39.37 33.55,39.16 U$1.3 | 33.34,39.37 33.26,39.45 U$1.99 | 33.34,41.91 33.3,41.95 U$1.94 | 38.1,22.86 38.1,33.97 38.05,34.02 U$1.12 | U$1.62 39.05,44.95 | 33.34,41.91 33.34,43.18 34.92,44.77 39.05,44.77 39.05,44.95 | 39.05,44.95 U$1.38 | U$1.3 33.55,35.77
  Top 0.305: IC4.26 IC4.25 | 88.9,48.31 89.48,48.31 90.17,47.62 90.17,46.04 90.47,45.73 U$2.5 | 88.9,48.31 IC4.25 | 84.14,48.58 arc2 84.14,45.72 | 84.14,45.72 84.14,44.45 85.14,43.76 IC4.18 | 84.14,48.58 87.76,48.58 IC4.25 | IC4.21 86.81,45.72 84.14,45.72 | 84.14,48.58 84.14,52.07 C9.1 | 87.93,52.07 C10.1 | S8.3 49.85,9.96 | C1.2 32.7,33.58 32.7,33.66 33.55,34.51 | C8.2 41.57,22.01 U$61.4 39.25,22.03 38.42,22.86 38.1,22.86 37.8,22.86 U$61.2 | C5.1 35,21.27 38.73,21.27 39.25,21.79 | v30.48,32.7 30.8,33.02 32.38,33.02 | v88.9,49.85 88.9,48.31 | IC4.7 81.28,46.35
  Top 0.406: U$68.3 33.98,16.51 v33.66,16.19 33.66,14.93 R_MD2.1 | 74.93,59.84 IC6.39 74.93,53.66 74.3,53.02 74.3,52.47 C42.1 73.03,52.39 72.07,53.34 63.82,53.34 v61.59,51.12 | 75.56,60.64 IC6.6 81.6,60.64 82.23,60.01 82.23,59.37 82.55,59.05 83.74,59.05 C40.1 | 75.56,60.64 75.73,60.81 IC6.16 75.73,67.79 76.2,68.26 76.2,69.14 C41.1 76.2,69.29 v76.2,71.12 | 74.93,59.84 IC6.29 67.78,59.84 67.31,59.37 66.75,59.37 C46.2 | 75.56,60.64 74.93,60.01 74.93,59.84 | C6.1 95.25,51.62 95.25,45.72 | 95.25,45.72 94.63,45.73 U$2.5 | 35,21.27 34.05,22.23 33.34,22.23 32.38,22.86 32.38,25.4 | 32.38,25.4 32.38,26.67 33.34,27.62 R_XCIN.1 | v28.57,25.4 32.38,25.4 | v72.39,27.3 71.75,27.3 70.8,28.26 v67.31,28.26 v63.82,28.26 v58.74,28.26 56.2,30.8 v56.2,35.24 | v56.83,41.27 62.55,35.56 76.2,35.56 76.83,34.92 81.6,34.92 82.87,36.2 82.87,40.01 | 82.87,40.01 87.95,40.01 88.9,39.05 v88.9,38.73 | 81.28,46.35 81.92,45.72 81.92,41.59 82.87,40.64 82.87,40.01 | v92.39,69.53 v98.11,69.53 | v89.22,24.45 90.49,25.72 99.38,25.72 | 95.25,45.72 95.57,45.4 95.57,38.1 96.52,37.15 v98.11,37.15 | 32.38,33.02 C1.2 | v79.69,16.83 77.47,19.37 77.47,26.67 75.88,28.26 v75.88,28.89
  Top 0.61: U$82.1 U$82.4 32.66,14.96 32.7,14.92 R_MD2.1 | C34.1 26.37,78.74 U$17.2 31.43,78.74 | 31.43,78.74 32.7,80.01 U$17.8 | C7.1 50.5,78.74 U$3.2 55.56,78.74 | 58.1,80.01 U$3.8 | C15.1 55.56,75.55 55.56,78.74 | 31.43,78.74 31.43,75.55 C35.1 32.38,74.6 32.38,70.48 | C9.1 87.93,52.07 C11.1 | v88.9,38.73 89.85,37.78 v93.34,37.78 | v79.69,16.83 80.01,0.64 | 55.56,78.74 56.83,80.01 58.1,80.01 | 58.1,80.01 v58.1,81.6
  Top 0.813: S4.3 S4.4 | S5.3 S5.4 | S7.4 S7.3 | S8.3 S8.4 | 23.56,72.32 U$11.GND@1 23.56,73.73 24.45,74.61 28.26,74.61 29.84,73.03 C3.2 29.84,70.17 30.16,70.48 32.38,70.48 34.58,70.48 U$26.2 34.63,70.48 40.96,70.48 | 40.96,70.48 C25.2 | C24.2 v44.13,70.48 40.96,70.48 | v76.83,49.85 76.52,49.85 74.37,51.99 C42.1
  Top 1.016: U$11.GND@2 U$11.GND@1 | U$11.ON/OFF 21.27,65.72 | 21.27,65.72 U$11.GND@0 21.27,56.52 U$8.K | U$11.GND@2 21.27,65.72 | U$8.K R40.2 | U$11.GND@2 21.27,77.28 C4.1 | U$8.K 21.27,56.5 R43.1 Q4.2 | LED1.C LED2.C 12.6,46.99 LED3.C LED4.C | IC1.1 10.31,12.7 9.21,12.7 7.94,11.43 5.08,11.43 | S4.4 16.15,1.31 16.83,0.64 27.3,0.64 | 38.42,0.64 49.53,0.64 | 49.53,0.64 61.91,0.64 | 61.91,0.64 80.01,0.64 88.9,0.64 v91.76,3.49 99.38,11.11 99.38,25.72 99.38,32.7 98.11,33.97 v98.11,37.15 | 27.3,0.64 38.42,0.64 | S7.3 38.42,3.06 38.42,0.64 | S5.3 27.3,9.56 | 27.3,0.64 27.3,3.06 | 27.3,3.06 27.3,3.17 | S5.4 27.3,3.06 | S8.4 49.53,3.06 49.53,0.64 | v61.91,2.54 61.91,0.64
  Top 1.27: v2.54,46.99 12.6,46.99 | LED3.C 12.6,21.05 R28.1 11.12,19.37 7.62,19.37 5.08,16.83 5.08,11.43 5.08,8.26 | 5.08,8.26 5.08,7.3 9.28,3.1 S4.4 | S3.4 2.9,8.26 5.08,8.26
  Bottom 0.406: R27.1 96.52,14.61 X1.12 X1.14 | R38.1 R49.2 | v30.48,32.7 30.16,32.38 30.16,28.89 28.57,27.3 v28.57,25.4 | 68.58,22.55 68.58,22.54 67.94,22.54 67.31,23.18 Q2.2 v67.31,28.26 | R50.2 v58.74,28.26 | v72.39,27.3 | v72.39,27.3 75.88,27.3 | v72.39,27.3 Q3.2 | v63.82,28.26 R48.2 62.87,26.67 62.23,26.03 Q1.2 | v56.2,35.24 C14.2 58.1,35.23 58.1,34.61 58.74,33.97 69.53,33.97 72.39,36.83 72.39,38.42 | C12.2 C2.2 v56.83,41.27 | C13.2 58.1,49.55 58.1,50.48 58.74,51.12 v61.59,51.12 | U$75.4 90.49,64.77 92.39,66.67 v92.39,69.53 | R9.1 v89.22,24.45 | 88.58,29.84 84.77,29.84 82.23,27.3 75.88,27.3 | v75.88,28.89 75.88,27.3
  Bottom 0.61: Q2.2 | 68.58,22.55 R49.2 | Q1.2 | U$32.9 U$32.10 v88.9,38.73 | v93.34,37.78 98.11,37.78 | v33.66,16.19 31.75,18.1 28.57,18.1 | 28.57,18.1 19.05,18.1 16.19,15.24 16.19,9.53 16.27,9.6 S4.3 | v28.57,25.4 28.57,18.1 | JP3.6 v79.69,16.83 | v58.1,81.6 57.78,81.92 57.78,83.5 | 57.78,83.5 57.78,90.81 | 50.48,70.48 50.48,80.96 53.02,83.5 57.78,83.5
  Bottom 0.813: X2.2 2.82,20.92 S3.3 S3.4 | X3.2 50.48,70.48 v44.13,70.48 | X4.2 72.26,45.2 | C17.2 U$32.10 | X1.2 93.34,29.84 88.58,29.84
  Bottom 1.016: U$27.P$8 17.78,90.61 | 17.78,90.61 U$27.P$6 | U$27.P$7 | U$9.P$8 36.83,90.61 | 36.83,90.61 U$9.P$6 | U$9.P$7 | U$9.P$7 36.83,90.61 | U$5.P$8 57.78,90.61 | 57.78,90.61 U$5.P$6 | U$5.P$7 | U$5.P$7 57.78,90.81 57.78,90.61 | U$4.P$6 76.83,90.61 | 76.83,90.61 U$4.P$8 | 76.83,90.61 U$4.P$7 76.83,98.42 76.83,99.06 | U$27.P$7 17.78,90.61 | U$27.P$7 17.78,99.06 36.83,99.06 | 36.83,99.06 57.78,99.06 | 57.78,99.06 76.83,99.06 | U$9.P$7 36.83,99.06 | U$5.P$7 57.78,99.06 | 76.83,99.06 98.11,99.06 99.06,97.79 99.06,75.25 98.11,74.3 v98.11,69.53 98.11,37.78 v98.11,37.15 | U$29.4 86.36,81.28 75.58,81.28 75.57,81.29 73.98,79.69 JP5.3 73.98,73.34 v76.2,71.12 | U$58.7 68.9,1.27 68.26,0.64 61.91,0.64 v61.91,2.54 | X1.14 96.2,9.84 91.76,5.4 v91.76,3.49
  Bottom 1.27: X4.2 X5.2 72.39,37.8 72.39,38.42 72.39,46.67 75.56,49.85 v76.83,49.85 | U$10.P$2 2.54,60.64 v2.54,46.99
  pour Bottom (isolate 0.813, no thermals): 0,100.01 100.01,100.01 100.01,0 0,0
  pour Top (isolate 0.813, no thermals): 0,100.01 100.01,100.01 100.01,0 0,0
IMU_INT  (via drill 0.8)
  Top 0.2: U$1.30 50.64,40.96
  Top 0.254: 50.64,40.96 55.4,36.2 57.78,36.2 60.33,33.66 73.66,33.66 77.47,29.84 78.74,29.84 78.11,29.84 81.28,29.84 83.82,32.38 87.63,32.38 88.9,33.34 v88.9,33.66
  Bottom 0.61: v88.9,33.66 U$32.8
MD  (via drill 0.8)
  Top 0.2: 35.56,31.75 35.55,32.08 U$1.7
  Top 0.305: 35.56,31.75 33.97,30.16 v31.43,30.16
  Top 0.406: U$68.4 41.59,16.51 | 41.59,16.51 43.59,16.51 arc90 LED5.C | v41.59,14.61 41.59,16.51 | SJ4.2 v54.29,53.66 | v52.07,38.1 50.48,36.51 50.48,24.77 53.66,21.59 53.66,15.56 56.2,13.02 v56.83,13.02
  Bottom 0.406: v31.43,30.16 31.43,21.91 38.73,14.61 v41.59,14.61 44.13,14.61 46.35,12.38 52.07,12.38 52.7,13.02 v56.83,13.02 57.78,13.65 74.93,13.65 80.64,19.37 X1.7 | v54.29,53.66 54.29,44.77 52.07,42.55 v52.07,38.1
MODE_SW_EN  (via drill 0.8)
  Top 0.406: U$68.1 38.1,18.41 38.73,17.78 38.73,15.56 38.1,14.92 R_MD2.2 37.15,14.29 36.51,13.65 25.72,13.65 24.77,14.61 24.77,25.4 v26.35,26.99 | SJ5.2 v50.48,56.2
  Top 0.61: v33.97,59.37 33.34,59.37 v29.53,55.56
  Bottom 0.406: v50.48,56.2 50.48,58.1 49.21,59.37 v33.97,59.37 | v29.53,55.56 29.53,39.37 31.11,37.78 31.11,36.2 29.21,34.29 29.21,29.21 26.99,26.99 v26.35,26.99
MTCLKA  (via drill 0.8)
  Top 0.2: 52.19,41.95 U$1.32
  Top 0.254: v54.77,39.37 52.19,41.95
  Bottom 0.61: U$56.2 v54.77,39.37
MTCLKA_I
  Bottom 0.61: R20.1 60.64,41.27 | 60.64,41.27 C2.1 | 60.64,39.37 D2.A | U$56.1 60.64,39.37 | 60.64,39.37 60.64,41.27
MTCLKB  (via drill 0.8)
  Top 0.2: 51.26,41.45 U$1.31
  Top 0.254: v56.04,37.15 55.56,37.15 51.26,41.45
  Bottom 0.61: U$59.2 v56.04,37.15
MTCLKB_I
  Bottom 0.61: U$59.1 60.64,37.15 | 60.64,37.15 D3.A | 60.64,35.24 R21.1 | C14.1 60.64,35.24 | 60.64,35.24 60.64,37.15
MTCLKC  (via drill 0.8)
  Top 0.2: 55.14,49.95 U$1.48
  Top 0.254: v56.2,48.9 55.14,49.95
  Bottom 0.61: U$6.2 v56.2,48.9
MTCLKC_I
  Bottom 0.61: 60.64,47.31 D4.A | C13.1 60.64,49.53 | 60.64,49.53 R18.1 | U$6.1 60.64,47.31 | 60.64,47.31 60.64,49.53
MTCLKD  (via drill 0.8)
  Top 0.2: 53.74,49.45 U$1.47
  Top 0.254: v56.2,46.99 53.74,49.45
  Bottom 0.61: U$55.2 56.83,45.09 56.2,45.72 v56.2,46.99
MTCLKD_I
  Bottom 0.61: U$55.1 60.64,45.09 | 60.64,45.09 D5.A | 60.64,43.18 R19.1 | C12.1 60.64,43.18 | 60.64,43.18 60.64,45.09
MTIOC4A
  Top 0.2: 25.89,50.95 U$1.76
  Top 0.254: R43.2
  Top 0.305: R43.2 24.45,52.39 25.89,50.95
  Top 1.016: Q4.1 R43.2
N$1
  Top 0.2: 36.04,31.27 36.05,31.29 U$1.8
  Top 0.305: R_XCIN.2 34.92,29.84 35.88,30.8 36.04,31.27
N$2
  Top 0.2: 39.55,28.07 U$1.15
  Top 0.254: 40.64,26.99
  Top 0.305: R_NMI.2 40.64,26.99 | 40.64,26.99 39.55,28.07
N$3
  Top 0.406: R_MD3.1 42.86,20.32 43.5,19.68 LED5.A
N$4
  Top 0.406: U$7.6 16.29,15.88 R22.2
  Top 0.61: U$7.6 U$7.3
N$5
  Top 0.305: IC4.16 85.33,42.46 84.77,41.91 84.77,41.59 85.41,40.96 88.58,40.96 89.85,42.23 89.85,42.86 90.32,43.33 U$2.2
N$6
  Top 0.305: U$2.3 90.17,44.13 89.22,43.18 89.22,42.55 88.48,41.81 IC4.15
N$7
  Bottom 0.61: JP2.1 7.3,90.48 R3.2
N$8  (via drill 0.8)
  Top 0.61: U$3.7 60.01,78.74 61.91,80.64 61.91,84.14 | 61.91,84.14 v59.69,84.14 | 61.91,84.14 v78.74,84.14 82.23,84.14 85.41,87.31 v90.81,87.31
  Bottom 0.305: 59.69,89.53 59.81,89.66 U$5.P$5 | 78.74,89.53 78.86,89.66 U$4.P$5
  Bottom 0.61: v59.69,84.14 59.69,89.53 | v78.74,84.14 78.74,89.53 | JP1.2 v90.81,87.31
N$9  (via drill 0.8)
  Top 0.61: U$3.6 60.64,77.47 63.18,80.01 v63.18,82.55
  Bottom 0.61: U$5.P$4 60.84,83.31 61.59,82.55 v63.18,82.55 79.06,82.55 79.89,83.38 79.89,88.58 | 79.89,88.58 U$4.P$4 | R4.1 89.85,89.22 89.22,88.58 79.89,88.58
N$10
  Bottom 0.61: R4.2 JP1.1
N$11
  Top 0.2: 21.62,50.45 U$1.77
  Top 0.305: R5.2 20.32,49.21 21.56,50.45 21.62,50.45
N$12
  Top 0.2: 22.01,49.95 U$1.78
  Top 0.305: R6.2 19.68,47.62 22.01,49.95
N$13
  Top 0.2: 22.91,48.95 U$1.80
  Top 0.305: R7.2 20,46.04 22.91,48.95
N$14  (via drill 0.8)
  Top 0.61: U$17.7 35.56,78.74 36.51,79.69 36.51,84.14 | 36.51,84.14 v38.73,84.14 | 36.51,84.14 v19.68,84.14
  Bottom 0.305: 19.68,89.53 19.81,89.66 U$27.P$5 | 38.73,89.53 38.86,89.66 U$9.P$5
  Bottom 0.61: v19.68,84.14 19.68,87 | 19.68,87 19.68,89.53 | v38.73,84.14 38.73,89.53 | JP2.2 13.65,92.71 14.92,91.44 14.92,88.58 16.51,87 19.68,87
N$15  (via drill 0.8)
  Top 0.61: U$17.6 37.47,77.47 38.73,78.74 v38.73,82.23
  Bottom 0.61: 20.83,82.23 v38.73,82.23 39.37,82.23 39.88,82.74 U$9.P$4 | 20.83,82.23 17.78,82.23 12.06,87.95 R3.1 | 20.83,82.23 U$27.P$4
N$16
  Top 1.016: LED1.A R5.1
N$17
  Top 0.61: R15.2 IC1.2
N$18
  Top 1.016: LED2.A R6.1
N$19
  Top 1.016: LED3.A R7.1
N$20
  Top 0.2: 22.46,49.45 U$1.79
  Top 0.305: R12.2 19.05,46.04 22.46,49.45
N$21
  Top 1.016: LED4.A R12.1
N$22
  Top 0.305: 82.87,48.31 82.87,44.13 83.89,43.11 IC4.17 | C9.2 82.87,52.05 82.87,48.31 | 82.87,48.31 IC4.4
N$23
  Top 0.305: R16.1 74.89,47.66 IC4.5
N$24
  Top 0.406: U$7.4 16.29,20.95 R28.2
  Top 0.61: U$7.4 U$7.1
N$25
  Bottom 0.61: D5.C X4.4
N$26
  Bottom 0.61: D4.C 68.26,47.31 69.87,45.7 X4.3
N$27
  Bottom 0.61: D2.C 68.9,39.37 69.87,38.4 X5.3
N$28
  Bottom 0.61: D3.C 66.67,37.15 67.31,37.78 X5.4
N$29
  Top 1.016: R41.2 U$8.A
N$30
  Top 1.016: R40.1 26.87,58.94 U$11.TRIM
N$32
  Top 0.2: C1.1 34.55,33.36 U$1.5
N$59
  Bottom 1.016: X2.3 U$33.1
N$60
  Bottom 0.61: X2.4 5.08,25.72 U$34.1
N$61
  Bottom 1.016: X2.5 U$35.1
N$62
  Bottom 0.61: X2.6 5.08,28.26 U$36.1
N$63
  Bottom 1.016: X2.7 U$37.1
N$64
  Bottom 0.61: X2.8 5.08,30.8 U$38.1
N$65
  Bottom 1.016: X2.9 U$39.1
N$66
  Bottom 0.61: X2.10 5.08,33.34 U$40.1
N$67
  Bottom 1.016: X2.11 U$41.1
N$68
  Bottom 0.61: X2.12 5.08,35.88 U$42.1
N$69
  Bottom 1.016: X2.13 U$43.1
N$70
  Bottom 0.61: X2.14 5.08,38.42 U$44.1
N$71
  Bottom 1.016: X2.15 U$45.1
N$72
  Bottom 0.61: X2.16 5.08,40.96 U$46.1
N$77  (via drill 0.8)
  Top 1.016: Q4.3 v14.61,53.34
  Bottom 1.27: v14.61,53.34 12.7,53.34 9.45,50.09 SG2.2
N$86
  Bottom 0.61: R45.1 Q1.3
N$90
  Top 0.406: U$82.5 33.02,18.41 33.97,17.46 U$68.2
  Top 0.61: U$82.2 U$82.5
N$91
  Bottom 0.61: U$58.1 64.88,17.46 61.91,17.46 61.28,18.1 R45.2
N$93
  Bottom 0.61: U$58.2 66.36,18.02 R46.2
N$94
  Bottom 0.61: U$58.4 71.44,18.02 R47.2
N$95
  Bottom 0.61: R46.1 Q2.3
N$96
  Bottom 0.61: R47.1 Q3.3
N$98
  Top 0.61: R57.1 LED8.C
N$99
  Top 0.61: R58.1 LED9.C
N$100
  Top 0.406: LED8.A 77.79,71.12 77.15,70.48 77.15,68.26 76.53,67.64 IC6.15
N$101
  Top 0.406: LED9.A 78.11,69 78.11,68.26 77.33,67.49 IC6.14
N$102
  Top 0.406: C40.2 83.82,60.64 82.87,60.64 82.07,61.44 IC6.7
N$103
  Bottom 0.813: U$76.1
  Bottom 1.27: U$76.1 U$75.1
N$104
  Top 0.406: U$82.6 31.65,20.95 33.02,20.95 33.97,20 R_MD4.2
  Top 0.61: U$82.3 U$82.6
NMCLR  (via drill 0.8)
  Top 0.406: R59.1 79.06,73.66 v79.06,74.61 | v73.03,68.58 74.13,67.47 IC6.18
  Bottom 0.406: v79.06,74.61 79.06,70.17 77.47,68.58 v73.03,68.58
  Bottom 1.016: v79.06,74.61 JP5.5
P22
  Top 0.2: 46.55,38.22 U$1.26
  Top 0.305: S8.1 54.29,9.88 54.29,11.11 52.7,12.7 47.94,12.7 46.67,13.97 46.67,21.27 48.58,23.18 48.58,36.2 46.55,38.22
  Top 0.813: S8.1 S8.2
  Bottom 0.813: R24.1 52.15,3.1 S8.2
P23
  Top 0.2: 46.87,36.95 U$1.25
  Top 0.305: S7.2 43.18,9.88 43.18,11.43 46.04,14.29 46.04,21.59 47.94,23.5 47.94,35.88 46.87,36.95
  Top 0.813: S7.2 S7.1
  Bottom 0.813: R23.2 41.04,3.1 S7.1
P24
  Top 0.2: 47.31,32.07 44.05,35.32 U$1.24
  Top 0.305: S5.1 32.07,9.88 32.07,11.11 33.02,12.06 42.86,12.06 45.4,14.61 45.4,21.91 47.31,23.81 47.31,32.07
  Top 0.813: S5.1 S5.2
  Bottom 0.813: R32.1 29.92,3.1 S5.2
P25
  Top 0.2: 46.67,31.91 43.55,35.03 U$1.23
  Top 0.305: S4.1 20.95,9.88 20.95,11.11 22.54,12.7 42.55,12.7 44.77,14.92 44.77,22.23 46.67,24.13 46.67,31.91
  Top 0.813: S4.1 S4.2
  Bottom 0.813: R31.2 18.81,3.1 S4.2
PA0  (via drill 0.8)
  Top 0.2: 35.05,59.18 U$1.70
  Top 0.254: v54.61,62.23 38.1,62.23 35.05,59.18
  Bottom 0.305: X3.3 v54.61,62.23
PA1  (via drill 0.8)
  Top 0.2: 35.55,58.89 U$1.69
  Top 0.254: v55.88,61.28 53.98,61.28 53.5,61.75 38.42,61.75 35.55,58.89
  Bottom 0.305: X3.4 55.88,67.63 v55.88,61.28
PA2  (via drill 0.8)
  Top 0.2: 36.05,58.59 U$1.68
  Top 0.254: v57.15,62.23 57.15,60.96 56.52,60.33 54.13,60.33 53.18,61.28 38.73,61.28 36.05,58.59
  Bottom 0.305: X3.5 v57.15,62.23
PA3  (via drill 0.8)
  Top 0.2: 36.55,58.3 U$1.67
  Top 0.254: v58.42,61.28 58.42,60.8 57.47,59.85 53.82,59.85 52.86,60.8 39.05,60.8 36.55,58.3
  Bottom 0.305: X3.6 58.42,67.63 v58.42,61.28
PA4  (via drill 0.8)
  Top 0.2: 37.05,58.01 U$1.66
  Top 0.254: v59.69,62.23 59.69,60.96 58.1,59.37 53.5,59.37 52.55,60.33 39.37,60.33 37.05,58.01
  Bottom 0.305: X3.7 v59.69,62.23
PA5  (via drill 0.8)
  Top 0.2: 37.55,57.71 U$1.65
  Top 0.254: v60.96,61.28 60.96,60.64 59.21,58.9 53.18,58.9 52.23,59.85 39.69,59.85 37.55,57.71
  Bottom 0.305: X3.8 60.96,67.63 v60.96,61.28
PA6  (via drill 0.8)
  Top 0.2: 38.05,57.42 U$1.64
  Top 0.254: v62.23,62.23 62.23,60.64 60.01,58.42 52.86,58.42 51.91,59.37 40.01,59.37 38.05,57.42
  Bottom 0.305: X3.9 v62.23,62.23
PA7  (via drill 0.8)
  Top 0.2: 38.55,57.13 U$1.63
  Top 0.254: v63.5,61.28 63.5,60.64 60.8,57.94 52.55,57.94 51.59,58.9 40.32,58.9 38.55,57.13
  Bottom 0.305: X3.10 63.5,67.63 v63.5,61.28
PC7  (via drill 0.8)
  Top 0.2: v50.01,48.42 49.98,48.45 U$1.45
  Top 0.406: v75.25,30.48 75.88,30.48 77.15,29.21 77.15,27.94 79.06,26.04 79.06,21.27 82.23,18.1 v84.45,18.1
  Bottom 0.406: 96.52,16.51 R27.2 | X1.10 94.93,18.1 v84.45,18.1 | v75.25,30.48 74.61,29.84 71.44,29.84 68.26,33.02 55.56,33.02 50.01,38.58 v50.01,48.42
  Bottom 0.61: X1.10 96.52,16.51
PGEC1  (via drill 0.8)
  Top 0.406: v68.9,72.71 68.9,66.67 | IC6.22 69.13,66.44 68.9,66.67 | 68.9,66.67 67.63,66.67 65.41,64.45 65.41,59.05 60.01,53.66 SJ4.1
  Bottom 1.016: JP5.1 v68.9,72.71
PGED1  (via drill 0.8)
  Top 0.406: v71.44,74.61 71.44,73.98 | 71.44,73.98 71.44,68.9 71.73,68.61 IC6.21 | SJ5.1 60.96,56.2 64.77,60.01 64.77,64.77 66.99,66.99 66.99,72.71 68.26,73.98 71.44,73.98
  Bottom 1.016: JP5.2 v71.44,74.61
PIC_DM  (via drill 0.8)
  Top 0.406: IC6.9 82.09,63.04 82.55,63.5 v84.14,63.5
  Bottom 0.406: v84.14,63.5 87.63,63.5 88.27,62.87 88.27,60.96 87.58,60.28 U$75.2
PIC_DP  (via drill 0.8)
  Top 0.406: IC6.8 80.74,62.23 v83.19,62.23
  Bottom 0.406: v83.19,62.23 86.63,62.23 arc90 U$75.3
RB9  (via drill 0.8)
  Top 0.406: IC6.1 80.64,56.56 v80.64,54.93 | v66.99,57.15 66.99,54.93 SJ1.2
  Bottom 0.406: v66.99,57.15 66.99,51.44 70.17,48.26 72.07,48.26 75.25,51.44 79.06,51.44 80.64,53.02 v80.64,54.93
RES#  (via drill 0.8)
  Top 0.2: U$1.10 37.05,29.43 36.99,29.37
  Top 0.305: 36.99,29.37 36.2,28.57
  Top 0.406: 36.2,28.57 25.72,28.57 23.81,26.67 23.81,15.24 v22.7,14.13 21.27,12.7 15.56,12.7 13.97,11.11 13.97,9.84 13.34,9.21 10.48,9.21 | SJ1.1 62.87,54.93 v62.23,54.29 | v53.34,36.83 51.12,34.61 51.12,25.08 54.29,21.91 54.29,15.88 55.24,14.92 56.83,14.92 58.1,13.65 v58.1,12.06
  Top 0.61: R15.1 10.48,9.21 9.45,8.18 S3.2
  Bottom 0.406: X1.13 87.63,11.75 83.82,15.56 77.79,15.56 75.25,13.02 59.05,13.02 v58.1,12.06 57.78,11.75 46.04,11.75 44.45,13.34 23.5,13.34 v22.7,14.13 | v62.23,54.29 60.01,52.07 56.52,52.07 54.93,50.48 54.93,44.13 53.34,42.55 v53.34,36.83
  Bottom 0.813: S3.2 S3.1
RXD0  (via drill 0.8)
  Top 0.2: 49.21,39.05 48.81,39.45 U$1.27
  Top 0.305: v56.52,8.26 56.52,10.16 52.39,14.29 52.39,20.95 49.21,24.13 49.21,39.05
  Bottom 0.406: JP3.1 79.06,4.13 75.88,7.3 57.47,7.3 v56.52,8.26
RXD1  (via drill 0.8)
  Top 0.2: 44.77,30.8 42.05,33.51 U$1.20
  Top 0.305: v44.13,23.5 42.86,24.77 42.86,25.72 44.77,27.62 44.77,30.8
  Bottom 0.406: JP7.3 46.99,17.78 44.77,20 44.77,22.86 v44.13,23.5
RXD2
  Top 0.2: 52.74,46.95 U$1.42
  Top 0.254: 72.07,50.48 73.98,50.48 75.88,48.58 77.47,48.58 79.16,50.26 IC4.1
  Top 0.305: 72.07,50.48 70.48,52.07 66.99,52.07 59.05,43.81 55.88,43.81 52.74,46.95
SBDBT1-RX  (via drill 0.8)
  Top 0.305: v56.04,17.78 58.58,20.32 75.25,20.32 76.83,21.91 76.83,26.35 73.66,29.53 v73.66,31.11
  Top 0.406: v84.14,57.15 83.05,58.24 IC6.3
  Bottom 0.305: JP7.2 53.5,20.32 v56.04,17.78 | 74.3,35.56 76.2,35.56
  Bottom 0.406: v73.66,31.11 73.66,34.92 74.3,35.56 | 76.2,35.56 76.83,36.2 76.83,40.96 84.14,48.26 v84.14,57.15
SBDBT1-TX  (via drill 0.8)
  Top 0.305: v56.04,19.37 57.47,20.95 74.93,20.95 76.2,22.23 76.2,26.04 72.39,29.84 v72.39,32.38
  Top 0.406: v82.87,55.88 82.87,57.15 82.58,57.44 IC6.2
  Bottom 0.305: JP7.1 49.53,21.59 53.82,21.59 v56.04,19.37
  Bottom 0.406: v72.39,32.38 72.39,35.24 73.34,36.2 75.88,36.2 76.2,36.51 76.2,41.59 82.87,48.26 v82.87,55.88
SCL0
  Top 0.2: 53.57,42.95 U$1.34
  Top 0.305: 53.57,42.95 61.59,34.92 74.93,34.92 76.2,33.66 U$32.3
  Bottom 0.813: R25.2 U$32.3
SDA0
  Top 0.2: 53.12,42.45 U$1.33
  Top 0.305: 53.12,42.45 61.28,34.29 74.3,34.29 77.47,31.11 U$32.4
  Bottom 0.813: R26.2 U$32.4
TCK  (via drill 0.8)
  Top 0.2: 45.4,31.11 42.55,33.97 U$1.21
  Top 0.305: v44.13,25.4 45.4,26.67 45.4,31.11
  Top 0.406: v83.82,20.64 v83.82,26.35
  Bottom 0.305: R8.2 92.39,27.62
  Bottom 0.406: 92.39,27.62 91.76,28.26 88.9,28.26 87,26.35 v83.82,26.35 | v83.82,20.64 80.96,20.64 74.61,14.29 53.02,14.29 51.75,13.02 46.67,13.02 43.81,15.88 43.81,21.59 42.86,22.54 42.86,24.77 43.5,25.4 v44.13,25.4
  Bottom 0.61: R8.2 X1.1
TMS  (via drill 0.8)
  Top 0.2: 44.13,30.48 41.55,33.06 U$1.19
  Top 0.305: 44.13,30.48 44.13,28.57 v43.5,27.94
  Top 0.406: v52.39,25.72 54.93,25.72 57.15,23.5 72.39,23.5 73.34,23.5 v74.61,22.23 | v86.68,23.18 87,22.86 v87,16.83
  Bottom 0.305: v43.5,27.94 44.77,27.94 46.99,25.72 v52.39,25.72
  Bottom 0.406: X1.9 R11.2 91.75,16.19 91.12,15.56 88.27,15.56 v87,16.83 | v74.61,22.23 75.88,23.5 78.42,23.5 86.36,23.5 v86.68,23.18
TRST#  (via drill 0.8)
  Top 0.2: 40.16,29.05 40.05,29.16 U$1.16
  Top 0.305: 40.16,29.05 v40.96,28.26
  Top 0.406: v54.29,26.99 54.93,26.99 57.15,24.77 v74.93,24.77
  Bottom 0.305: v40.96,28.26 42.23,28.26 43.18,29.21 44.45,29.21 46.99,26.99 v54.29,26.99
  Bottom 0.406: X1.3 R9.2 92.39,23.81 91.76,23.18 88.9,23.18 87.63,24.45 75.25,24.45 v74.93,24.77
TXD0  (via drill 0.8)
  Top 0.2: 49.85,39.37 49.27,39.95 U$1.28
  Top 0.305: v57.47,10.48 53.02,14.92 53.02,21.27 49.85,24.45 49.85,39.37
  Bottom 0.406: JP3.2 77.79,6.67 76.52,7.94 58.74,7.94 57.47,9.21 v57.47,10.48
TXD1  (via drill 0.8)
  Top 0.2: 46.04,31.59 43.05,34.58 U$1.22
  Top 0.305: v45.4,24.45 46.04,25.08 46.04,31.59
  Bottom 0.406: JP7.4 49.53,19.05 47.62,19.05 45.4,21.27 v45.4,24.45
TXD2
  Top 0.2: U$1.44 48.9,47.94 49.37,47.47 53.01,47.47 53.02,47.47
  Top 0.305: R16.2 71.76,52.7 66.67,52.7 58.74,44.45 56.2,44.45 53.02,47.47
USB0_DM  (via drill 0.8)
  Top 0.2: 53.84,43.95 U$1.36
  Top 0.305: v71.12,49.53 66.36,49.53 59.69,42.55 55.24,42.55 53.84,43.95
  Bottom 0.61: R13.2 86.72,76.52 arc90 U$29.2 86.63,76.52 83.82,76.52 82.55,75.25 82.55,69.85 71.12,58.42 v71.12,49.53
USB0_DP  (via drill 0.8)
  Top 0.2: 54.29,44.45 U$1.37
  Top 0.305: v69.85,50.8 66.67,50.8 59.37,43.18 55.56,43.18 54.29,44.45
  Bottom 0.61: R14.2 86.72,78.42 arc-90 U$29.3 86.63,78.42 84.14,78.42 81.28,75.56 81.28,70.48 69.85,59.05 v69.85,50.8
VBUS0
  Top 0.305: 92.82,42.55 93.98,42.55 94.61,41.91 94.61,37.47 95.86,36.22 D1.C
  Top 0.406: U$2.1 92.82,42.55
VCC  (via drill 0.8)
  Top 0.305: v89.22,45.09 89.19,45.06 IC4.20
  Top 0.406: v77.79,52.7 77.33,53.16 IC6.42
  Top 0.61: C34.2 26.37,77.47 U$17.3 29.84,77.47 30.48,76.83 v30.48,74.3 | 50.5,77.47 C7.2 50.47,77.47 | 50.5,77.47 U$3.3 | C11.2 89.23,51.75 | 89.23,51.75 C10.2 | v90.81,51.75 89.23,51.75 | 29.84,62.75 v29.84,61.91 | 50.5,77.47 v41.59,77.47 | v78.42,40.96 78.11,41.27 v78.11,46.35
  Top 0.813: U$11.VOUT 26.67,70.5 v26.67,73.03 | 29.84,64.26 30.04,64.26
  Top 1.016: R41.1 v13.02,56.52 | U$11.SENSE 26.95,65.8 | U$11.VOUT U$11.SENSE | C3.1 29.84,65.72 | 30.04,64.26 U$26.1 | U$11.SENSE 29.84,65.72 | v29.84,92.71 33.34,92.71 36.2,95.57 42.55,95.57 45.4,92.71 v49.85,92.71 54.61,92.71 57.47,95.57 63.5,95.57 66.36,92.71 v69.85,92.71 73.34,92.71 76.2,95.57 82.55,95.57 85.41,92.71 v89.53,92.71 | C6.2 v90.81,51.75 | 29.84,65.72 29.84,64.26 v29.84,61.91
  Top 1.27: v88.9,36.2 90.17,34.92 D1.A
  Bottom 0.813: X4.1 75.06,45.27
  Bottom 1.016: 22.86,93.15 U$27.P$1 24.33,92.71 v29.84,92.71 | 22.86,93.15 U$27.P$3 | U$27.P$2 22.86,93.15 | U$9.P$3 41.91,93.15 | 41.91,93.15 U$9.P$1 | U$9.P$2 41.91,93.15 | 62.87,93.15 U$5.P$1 64.33,92.71 v69.85,92.71 | 62.87,93.15 U$5.P$3 | U$5.P$2 62.87,90.62 62.87,93.15 | U$4.P$1 81.92,93.15 | 81.92,93.15 U$4.P$3 | U$4.P$2 81.92,93.15 | 95.57,45.09 95.25,45.09 | 95.57,73.98 95.56,73.97
  Bottom 1.27: 90.17,36.2 v88.9,36.2 | SG2.1 6.43,56.52
  Bottom 1.422: U$9.P$1 43.38,92.71 v49.85,92.71 49.85,85.72 v41.59,77.47 31.11,77.47 29.21,75.56 | U$4.P$1 83.39,92.71 v89.53,92.71 95.89,92.71 97.16,91.44 97.16,83.19 95.57,81.6 95.57,73.98 95.57,57.78 | 95.57,57.78 95.57,51.75 | X5.1 X4.1 | v90.81,51.75 95.57,51.75 | v29.84,61.91 14.92,61.91 13.02,60.01 v13.02,56.52 6.43,56.52 | v26.67,73.03 29.21,75.56 | v30.48,74.3 29.21,75.56 | U$76.2 95.57,57.78 | 95.57,51.75 95.57,45.09 95.57,43.5 93.03,40.96 90.81,40.96 | 95.56,73.97 U$29.1 85.41,73.97 85.41,73.98 84.45,73.03 84.45,69.22 77.79,62.55 v77.79,52.7 | 90.81,40.96 90.81,36.83 90.17,36.2 | 95.25,45.09 v89.22,45.09 | 75.06,45.27 76.14,46.35 v78.11,46.35 | 90.81,40.96 v78.42,40.96
VIN1
  Bottom 1.422: U$10.P$1 S6.2
VIN2  (via drill 0.8)
  Top 1.016: U$11.VIN@1 15.56,70.42 15.56,71.12 16.51,72.07 17.46,72.07 | 17.46,72.07 18.73,72.07 18.98,71.82 U$11.VIN@0 | 17.46,72.71 17.46,72.07
  Top 1.27: v15.24,74.61 17.46,74.61 | 17.46,74.61 17.46,77.34 C4.2 | 17.46,74.61 17.46,72.71
  Bottom 1.422: S6.1 9.53,77.15 12.06,74.61 v15.24,74.61
XTAL
  Top 0.2: 37.55,25.8 U$1.11 | C5.2 34.85,23.81
  Top 0.254: U$61.3 36.85,21.91 36.2,21.91 35.88,22.23
  Top 0.305: 35.88,22.23 35.88,23.81 | 35.88,23.81 35.88,24.13 37.55,25.8 | 34.85,23.81 35.88,23.81